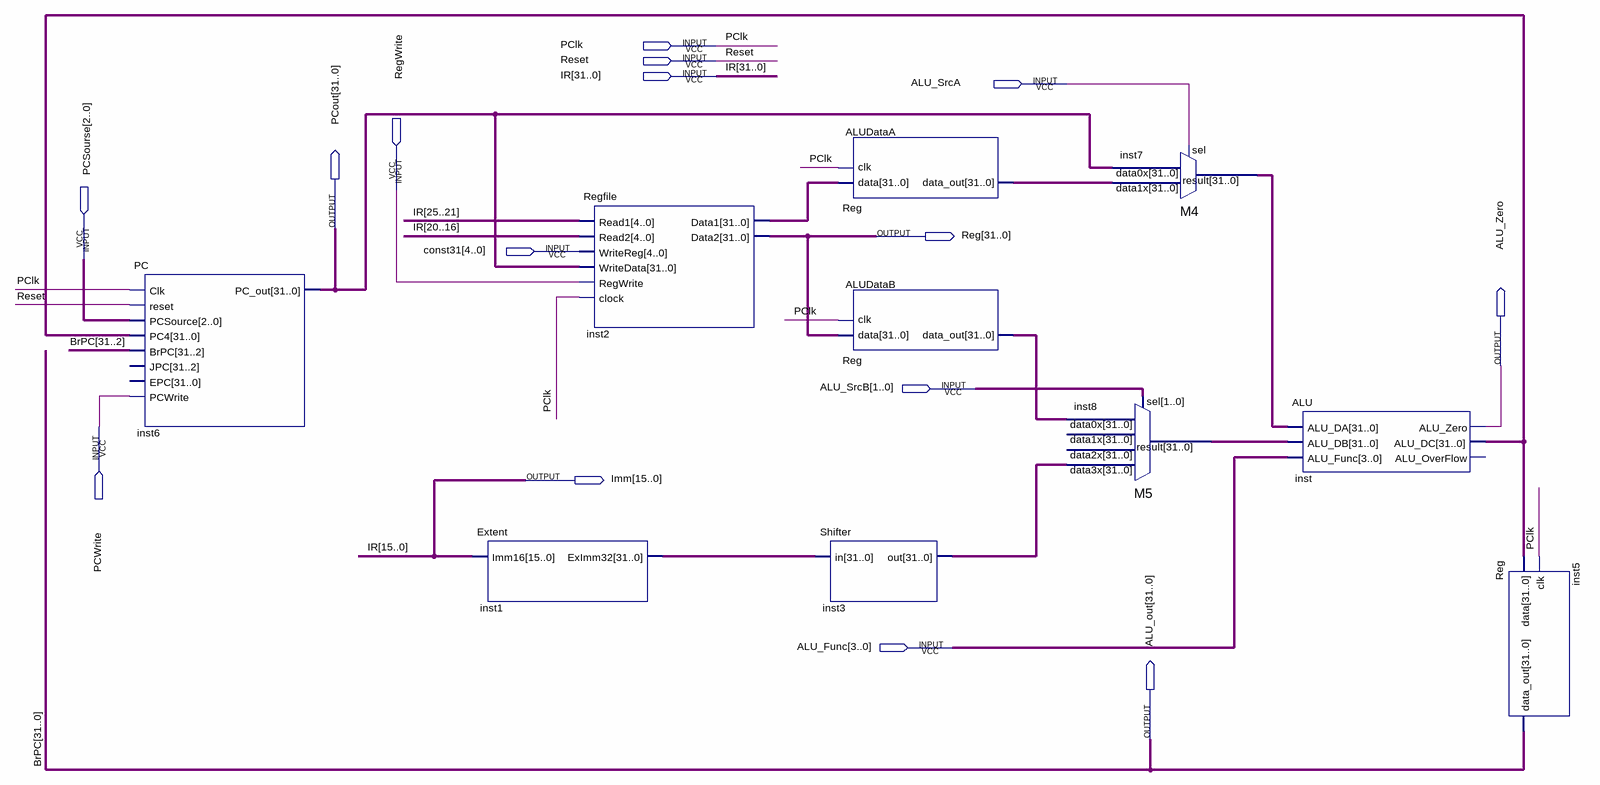
[diagram p0: schematic sheet]
// Quartus schematic beg.bdf as structural Verilog: 10 symbols, 15 pins
module beg (
  input  PClk,
  input  Reset,
  input  [31:0] IR,
  input  ALU_SrcA,
  input  RegWrite,
  input  [4:0] const31,
  input  [2:0] PCSourse,
  input  [1:0] ALU_SrcB,
  input  PCWrite,
  input  [3:0] ALU_Func,
  output [31:0] PCout,
  output [31:0] Reg,
  output ALU_Zero,
  output [15:0] Imm,
  output [31:0] ALU_out
);

  wire [31:0] ALUDataA_data_out, ALUDataB_data_out, inst1_eximm32, inst2_data1, inst3_out, inst7_result,
       inst8_result, inst_alu_dc;

  PC inst6 (
    .Clk(PClk), .reset(Reset), .PCSource(PCSourse), .PC4(inst_alu_dc), .BrPC(ALU_out[31:2]),
    .PCWrite(PCWrite), .PC_out(PCout));  // open: JPC, EPC
  Extent inst1 (.Imm16(IR[15:0]), .ExImm32(inst1_eximm32));
  Regfile inst2 (
    .Read1(IR[25:21]), .Read2(IR[20:16]), .WriteReg(const31), .WriteData(PCout), .RegWrite(RegWrite),
    .clock(PClk), .Data1(inst2_data1), .Data2(Reg));
  Shifter inst3 (.in(inst1_eximm32), .out(inst3_out));
  Reg ALUDataA (.data(inst2_data1), .clk(PClk), .data_out(ALUDataA_data_out));
  Reg ALUDataB (.data(Reg), .clk(PClk), .data_out(ALUDataB_data_out));
  M5 inst8 (
    .data3x(inst3_out), .data0x(ALUDataB_data_out), .sel(ALU_SrcB), .result(inst8_result));  // open: data2x, data1x
  M4 inst7 (.data1x(ALUDataA_data_out), .data0x(PCout), .sel(ALU_SrcA), .result(inst7_result));
  ALU inst (
    .ALU_DA(inst7_result), .ALU_DB(inst8_result), .ALU_Func(ALU_Func), .ALU_Zero(ALU_Zero),
    .ALU_DC(inst_alu_dc));  // open: ALU_OverFlow
  Reg inst5 (.data(inst_alu_dc), .clk(PClk), .data_out(ALU_out));

  assign Imm = IR[15:0];

  // Other names for the same wires on the sheet: BrPC[31:0] = ALU_out
endmodule
